# EAGLE design racket (EAGLE 8.4.1)
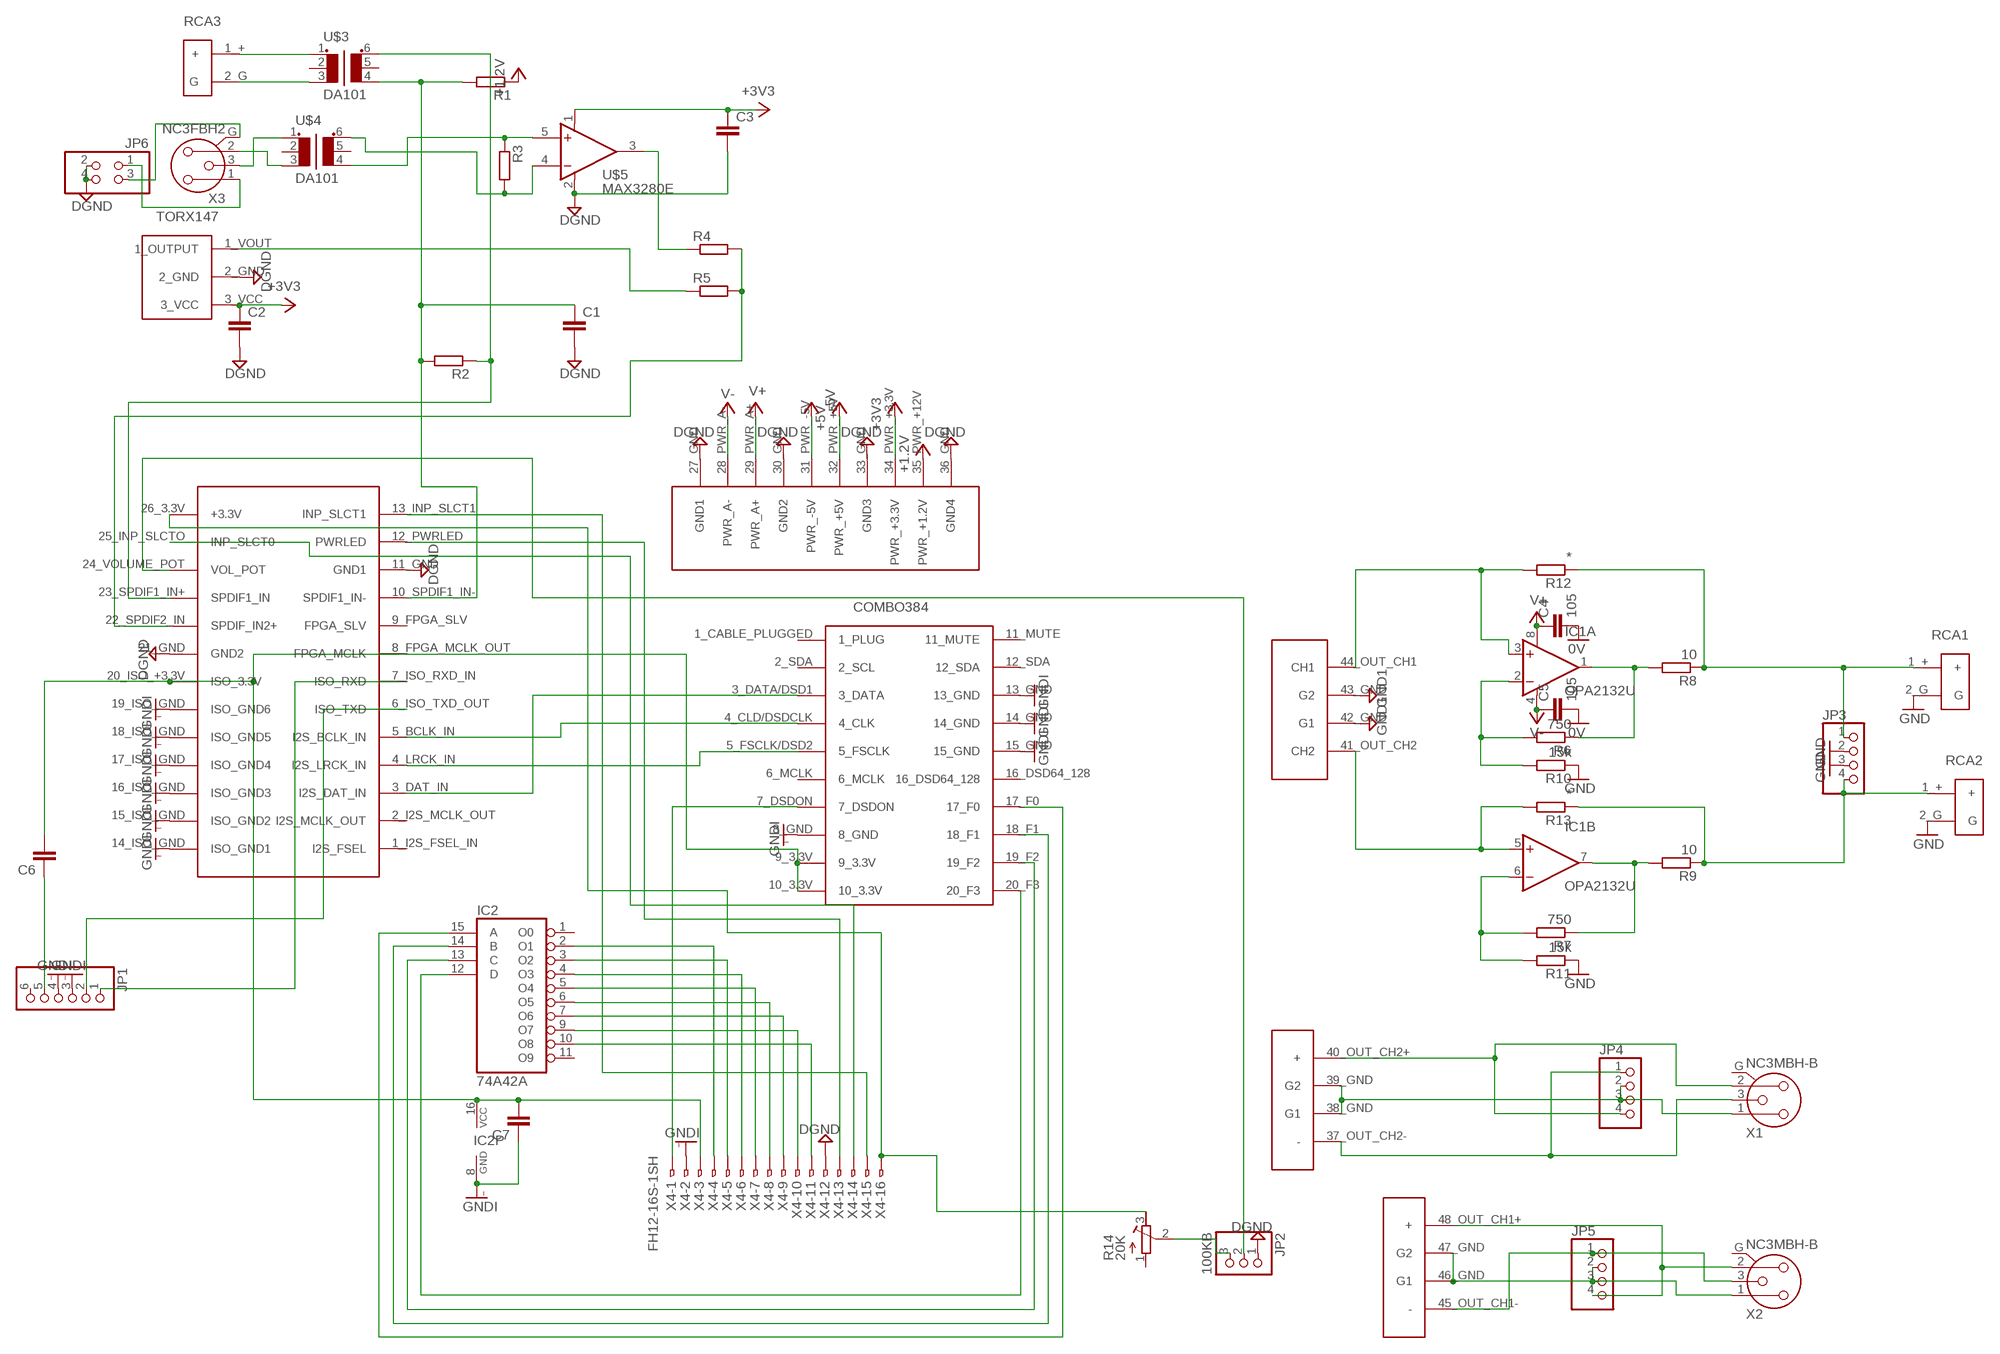
[diagram p0: schematic, sheet 1]

## Parts
C1  C-EUC1206K  [C1206K]
C2  C-EUC1206K  [C1206K]
C3  C-EUC1206K  [C1206K]
C4  105  C-EUC1206K  [C1206K]
C5  105  C-EUC1206K  [C1206K]
C6  C-EUC1206K  [C1206K]
C7  C-EUC1206K  [C1206K]
IC1  OPA2132U  [SO08]
IC2  74A42A  [SO16NS]
JP1  PINHD-1X6  [1X06]
JP2  100KB  PINHD-1X3  [1X03]
JP3  PINHD-1X4  [1X04]
JP4  PINHD-1X4  [1X04]
JP5  PINHD-1X4  [1X04]
JP6  PINHD-2X2  [2X02]
R1  R-EU_M1206  [M1206]
R2  R-EU_M1206  [M1206]
R3  R-EU_M1206  [M1206]
R4  R-EU_M1206  [M1206]
R5  R-EU_M1206  [M1206]
R6  750  R-EU_M1206  [M1206]
R7  750  R-EU_M1206  [M1206]
R8  10  R-EU_M1206  [M1206]
R9  10  R-EU_M1206  [M1206]
R10  15k  R-EU_M1206  [M1206]
R11  15k  R-EU_M1206  [M1206]
R12  *  R-EU_M1206  [M1206]
R13  *  R-EU_M1206  [M1206]
R14  20K  R-TRIMM64W  [RTRIM64W]
RCA1  RCA  [RCA]
RCA2  RCA  [RCA]
RCA3  RCA  [RCA]
U$1  TORX178  [TORX178B]
U$2  DAM1021  [DAM1021]
U$3  DA101  [DAC101]
U$4  DA101  [DAC101]
U$5  MAX3280E  [SOT23-5L]
USB1  COMBO384  [COMBO384_B]
X1  NC3MBH-B  [NC3MBH-B]
X2  NC3MBH-B  [NC3MBH-B]
X3  NC3FBH2  [NC3FBH2]
X4  FH12-16S-1SH  [FH12-16S-1SH]

## Nets
0V: C4.2 C5.2
+1V2: R1.1 U$2.35_PWR_+12V(PWR_+1.2V) ; supply symbol labelled +1.2V
+3V3: C2.1 C3.1 U$1.3_VCC U$2.34_PWR_+3.3V(PWR_+3.3V) U$5.1(V+)
+5V: U$2.32_PWR_+5V(PWR_+5V)
-5V: U$2.31_PWR_-5V(PWR_-5V)
DGND: C1.2 C2.2 C3.2 JP2.1 JP6.2 JP6.4 U$1.2_GND U$2.11_GND(GND1) U$2.21_GND(GND2) U$2.27_GND(GND1) U$2.30_GND(GND2) U$2.33_GND(GND3) U$2.36_GND(GND4) U$5.2(V-) X4.12
GND: JP3.2 JP3.3 R10.1 R11.1 RCA1.2_G(G) RCA2.2_G(G)
GND1: U$2.42_GND(G1) U$2.43_GND(G2)
GNDI: C7.1 IC2.8(GND) JP1.3 JP1.4 U$2.14_ISO_GND(ISO_GND1) U$2.15_ISO_GND(ISO_GND2) U$2.16_ISO_GND(ISO_GND3) U$2.17_ISO_GND(ISO_GND4) U$2.18_ISO_GND(ISO_GND5) U$2.19_ISO_GND(ISO_GND6) USB1.8_GND USB1.13_GND USB1.14_GND USB1.15_GND X4.2
N$2: RCA3.1_+(+) U$3.1
N$3: RCA3.2_G(G) U$3.3
N$4: JP3.4 R9.1 R13.1 RCA2.1_+(+)
N$5: C1.1 R1.2 R2.2 U$2.10_SPDIF1_IN-(SPDIF1_IN-) U$3.4
N$6: R2.1 U$2.23_SPDIF1_IN+(SPDIF1_IN) U$3.6
N$7: JP3.1 R8.1 R12.1 RCA1.1_+(+)
N$8: U$4.3 X3.2
N$9: U$4.1 X3.3
N$10: R3.1 U$4.4 U$5.5(+IN)
N$11: R3.2 U$4.6 U$5.4(-IN)
N$12: R4.1 U$5.3(OUT)
N$13: R5.1 U$1.1_VOUT(1_OUTPUT)
N$14: R4.2 R5.2 U$2.22_SPDIF2_IN(SPDIF_IN2+)
N$15: IC1.3(A:+IN) R12.2 U$2.44_OUT_CH1(CH1)
N$16: JP1.2 U$2.6_ISO_TXD_OUT(ISO_TXD)
N$17: IC1.2(A:-IN) R6.2 R10.2
N$18: IC1.1(A:OUT) R6.1 R8.2
N$19: IC1.6(B:-IN) R7.2 R11.2
N$20: IC1.7(B:OUT) R7.1 R9.2
N$21: IC1.5(B:+IN) R13.2 U$2.41_OUT_CH2(CH2)
N$22: JP1.1 U$2.7_ISO_RXD_IN(ISO_RXD)
N$23: C6.2 C7.2 IC2.16(VCC) U$2.20_ISO_+3.3V(ISO_3.3V) USB1.9_3.3V USB1.10_3.3V X4.3
N$24: C6.1 JP1.5
N$25: IC2.4(O3) X4.6
N$26: USB1.7_DSDON X4.1
N$27: IC2.5(O4) X4.7
N$28: IC2.2(O1) X4.4
N$29: IC2.3(O2) X4.5
N$30: IC2.6(O5) X4.8
N$31: IC2.7(O6) X4.9
N$32: IC2.9(O7) X4.10
N$33: IC2.10(O8) X4.11
N$34: U$2.12_PWRLED(PWRLED) X4.13
N$35: U$2.25_INP_SLCTO(INP_SLCT0) X4.14
N$36: R14.3(E) U$2.26_3.3V(+3.3V) X4.16
N$37: U$2.13_INP_SLCT1(INP_SLCT1) X4.15
N$38: IC2.12(D) USB1.20_F3
N$39: IC2.13(C) USB1.19_F2
N$40: IC2.14(B) USB1.18_F1
N$41: IC2.15(A) USB1.17_F0
N$42: JP2.2 U$2.24_VOLUME_POT(VOL_POT)
N$43: JP2.3 R14.2(S)
N$44: U$2.3_DAT_IN(I2S_DAT_IN) USB1.3_DATA/DSD1(3_DATA)
N$45: U$2.4_LRCK_IN(I2S_LRCK_IN) USB1.5_FSCLK/DSD2(5_FSCLK)
N$46: U$2.5_BCLK_IN(I2S_BCLK_IN) USB1.4_CLD/DSDCLK(4_CLK)
N$47: JP4.4 U$2.40_OUT_CH2+(+) X1.2
N$48: JP4.1 U$2.37_OUT_CH2-(-) X1.3
N$49: JP4.2 JP4.3 U$2.38_GND(G1) U$2.39_GND(G2) X1.1
N$51: JP5.2 JP5.3 U$2.46_GND(G1) U$2.47_GND(G2) X2.1
N$53: JP5.4 U$2.48_OUT_CH1+(+) X2.2
N$54: JP6.3 X3.G
N$55: JP5.1 U$2.45_OUT_CH1-(-) X2.3
N$56: JP6.1 X3.1
V+: C4.1 IC1.8(A:V+) U$2.29_PWR_A+(PWR_A+)
V-: C5.1 IC1.4(A:V-) U$2.28_PWR_A-(PWR_A-)
Unconnected: IC2.1(O0) IC2.11(O9) JP1.6 R14.1(A) U$2.1_I2S_FSEL_IN(I2S_FSEL) U$2.2_I2S_MCLK_OUT(I2S_MCLK_OUT) U$2.8_FPGA_MCLK_OUT(FPGA_MCLK) U$2.9_FPGA_SLV(FPGA_SLV) U$3.2 U$3.5 U$4.2 U$4.5 USB1.1_CABLE_PLUGGED(1_PLUG) USB1.2_SDA(2_SCL) USB1.6_MCLK USB1.11_MUTE USB1.12_SDA USB1.16_DSD64_128 X1.G X2.G

## Library data of the parts
C1-C7 = Vwvwbg:C-EU: CAPACITOR, European symbol
IC1 = burr-brown:OPA2132: High Speed FET-Input Operational Amplifiers< Product Folder:OPA2132; MF: TEXAS INSTRUMENTS; MPN: OPA2132U; OC_FARNELL: 1206934; OC_NEWARK: 80K6015
IC2 = 74xx-eu:74*42: 4-line to 10-line DECODER (1-of-10)
JP1 = pinhead:PINHD-1X6: PIN HEADER
JP2 = pinhead:PINHD-1X3: PIN HEADER
JP3-JP5 = pinhead:PINHD-1X4: PIN HEADER
JP6 = pinhead:PINHD-2X2: PIN HEADER
R1-R13 = Vwvwbg:R-EU_: RESISTOR, European symbol
R14 = resistor:R-TRIMM: Trimm resistor
RCA1-RCA3 = Vwvwbg:RCA
U$1 = Vwvwbg:TORX178
U$2 = Vwvwbg:DAM1021
U$3 U$4 = trafo:DA101
U$5 = maxim:MAX3280E
USB1 = Vwvwbg:COMBO384
X1 X2 = con-neutrik_ag:NC3: Neutrik Audio Connector XLR SERIES Stereo 1/4" jack Source: www.neutrik.com/; MPN: NC3MBH-B; OC_FARNELL: unknown; OC_NEWARK: 27B4288
X3 = con-neutrik_ag:NC3: Neutrik Audio Connector XLR SERIES Stereo 1/4" jack Source: www.neutrik.com/; MPN: NC3FBH2; OC_FARNELL: unknown; OC_NEWARK: 27B4226
X4 = con-hirose:FH12-16S-1S: 1mm Pitch Connectors For FPC/FFC Source: Data sheet <http://www.hirose.co.jp/cataloge_hp/e58605370.pdf>; OC_FARNELL: unknown; OC_NEWARK: unknown

## Board
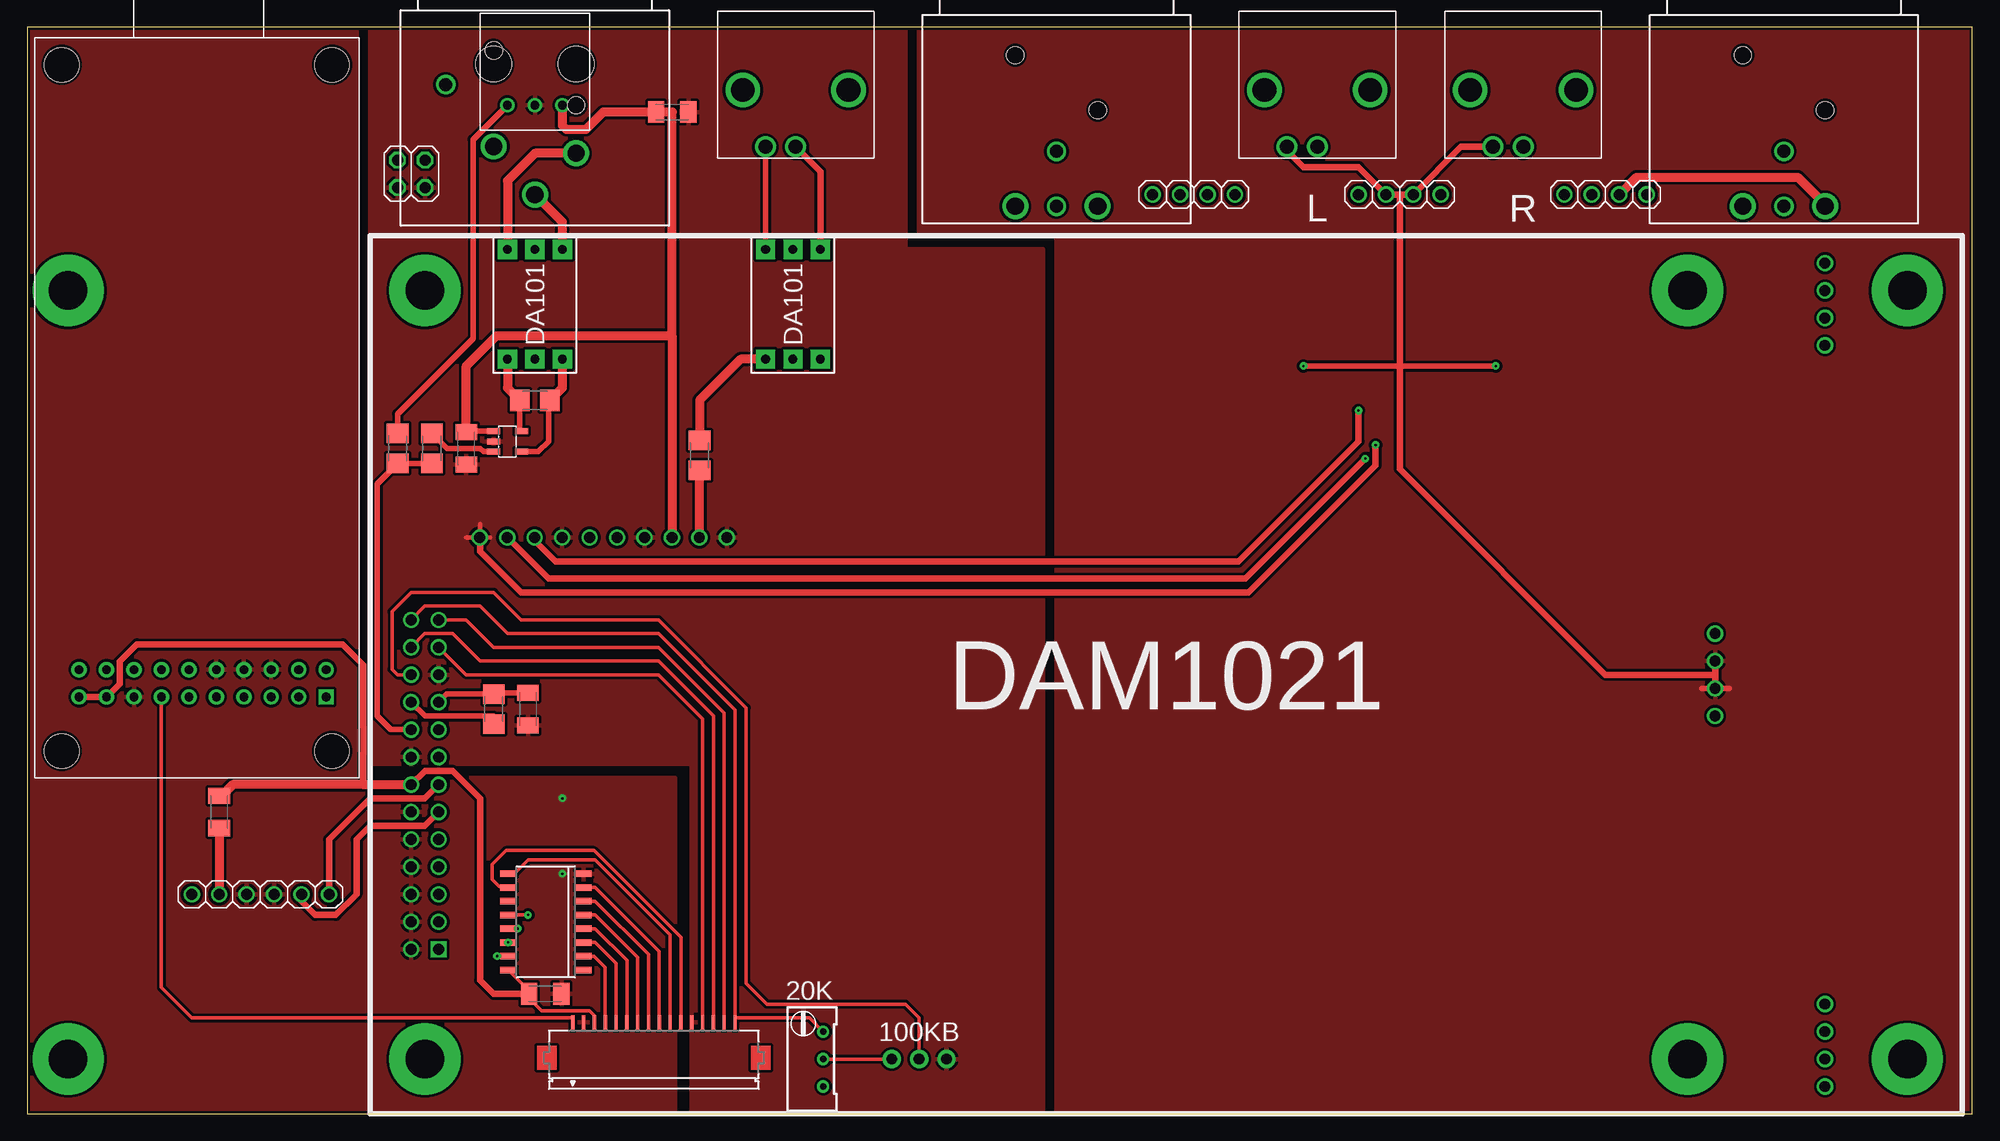
[diagram p1: board, top side]
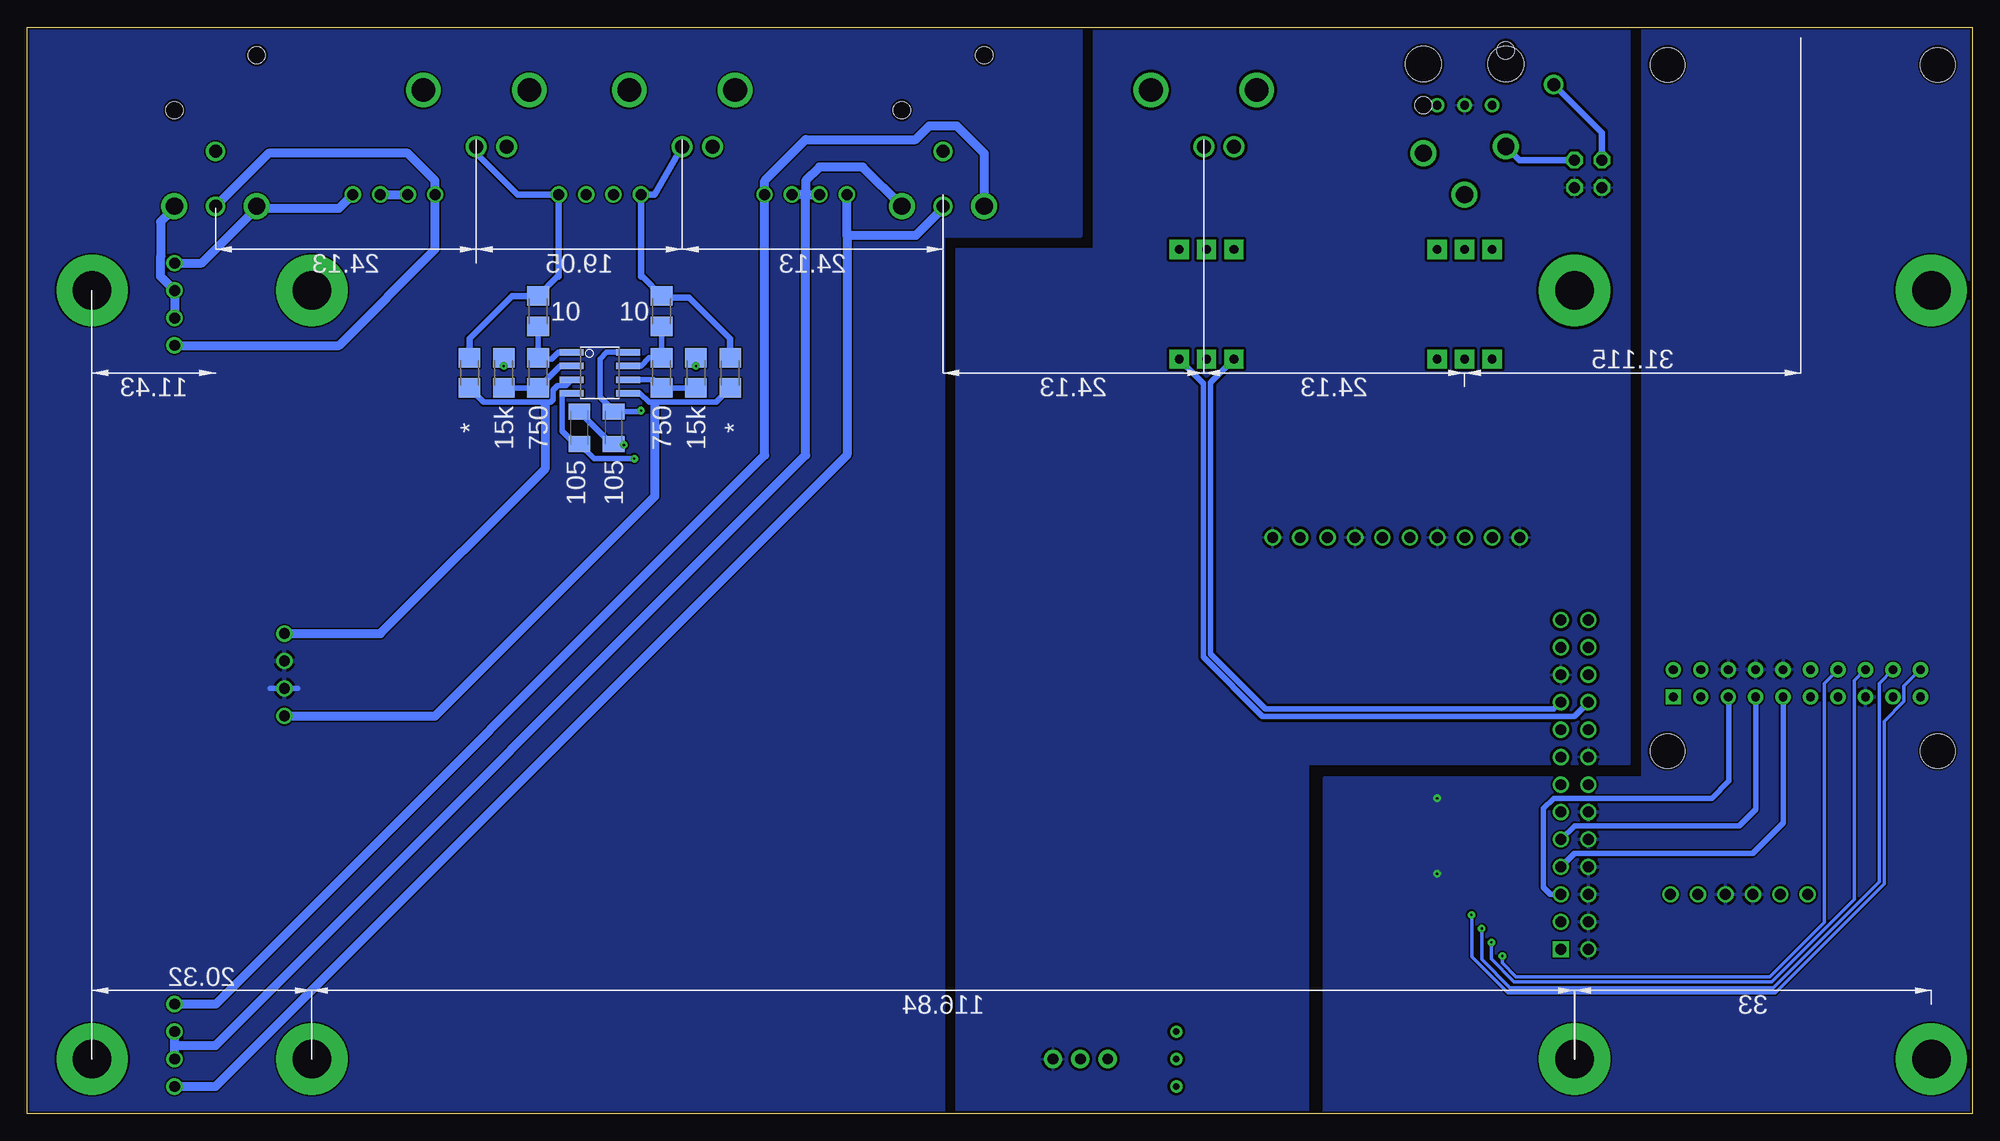
[diagram p2: board, bottom side, seen from below]

Size 180 x 100.58 mm. Coordinates in mm from the lower left corner, seen from the top.
Outline: 0,0 180,0 180,100.58 0,100.58 0,0
Copper layers (1*16): Top 0.035mm / dielectric 1.5mm / Bottom 0.035mm
Design rules "default *": minimum track width 6mil, minimum drill 0.35mm, track to track 6mil, track to pad 6mil, pad to pad 6mil, via to via 6mil, smd to smd 6mil, copper to edge 8mil, drill to drill 6mil, minimum pad ring 10mil, minimum via ring 8mil, stop-mask expansion 4mil, vias tented up to drill 9mil, thermal gap 10mil

### Footprints (pad centres in the part's own frame; a part is rotated, then mirrored left to right if it is on the bottom)
C1206K = smd 1.5 x 2: 1 -1.5,0; 2 1.5,0
SO08 = smd 0.61 x 2.21: 1 -1.905,-2.616; 2 -0.635,-2.616; 3 0.635,-2.616; 4 1.905,-2.616; 5 1.905,2.616; 6 0.635,2.616; 7 -0.635,2.616; 8 -1.905,2.616
SO16NS = smd 0.6 x 1.5: 1 -4.445,-3.49; 2 -3.175,-3.49; 3 -1.905,-3.49; 4 -0.635,-3.49; 5 0.635,-3.49; 6 1.905,-3.49; 7 3.175,-3.49; 8 4.445,-3.49; 9 4.445,3.49; 10 3.175,3.49; 11 1.905,3.49; 12 0.635,3.49; 13 -0.635,3.49; 14 -1.905,3.49; 15 -3.175,3.49; 16 -4.445,3.49
1X06 = drill 1.016: 1 -6.35,0; 2 -3.81,0; 3 -1.27,0; 4 1.27,0; 5 3.81,0; 6 6.35,0
1X03 = drill 1.016 pad 1.676: 1 -2.54,0; 2 0,0; 3 2.54,0
1X04 = drill 1.016: 1 -3.81,0; 2 -1.27,0; 3 1.27,0; 4 3.81,0
2X02 = drill 1.016 octagon: 1 -1.27,-1.27; 2 -1.27,1.27; 3 1.27,-1.27; 4 1.27,1.27
M1206 = smd 1.803 x 2: 1 -1.4,0; 2 1.4,0
RTRIM64W = drill 0.61: 1 1.27,-2.54; 2 1.27,0; 3 1.27,2.54
RCA = drill 1.3: 1_+ 0,0; 2_G -2.8,0 | drill 2.2: 3_NC -4.9,5.25; 4_NC 4.9,5.25
TORX178B = drill 0.8: 1_VOUT -2.54,0; 2_GND 0,0; 3_VCC 2.54,0 | hole 3.3: -3.81,3.81; 3.81,3.81
DAM1021 = drill 1 square: 1_I2S_FSEL_IN 1.27,10.16 | drill 1: 2_I2S_MCLK_OUT 1.27,12.7; 3_DAT_IN 1.27,15.24; 4_LRCK_IN 1.27,17.78; 5_BCLK_IN 1.27,20.32; 6_ISO_TXD_OUT 1.27,22.86; 7_ISO_RXD_IN 1.27,25.4; 8_FPGA_MCLK_OUT 1.27,27.94; 9_FPGA_SLV 1.27,30.48; 10_SPDIF1_IN- 1.27,33.02; 11_GND 1.27,35.56; 12_PWRLED 1.27,38.1; 13_INP_SLCT1 1.27,40.64; 14_ISO_GND -1.27,10.16; 15_ISO_GND -1.27,12.7; 16_ISO_GND -1.27,15.24; 17_ISO_GND -1.27,17.78; 18_ISO_GND -1.27,20.32; 19_ISO_GND -1.27,22.86; 20_ISO_+3.3V -1.27,25.4; 21_GND -1.27,27.94; 22_SPDIF2_IN -1.27,30.48; 23_SPDIF1_IN+ -1.27,33.02; 24_VOLUME_POT -1.27,35.56; 25_INP_SLCTO -1.27,38.1; 26_3.3V -1.27,40.64; 27_GND 5.08,48.26; 28_PWR_A- 7.62,48.26; 29_PWR_A+ 10.16,48.26; 30_GND 12.7,48.26; 31_PWR_-5V 15.24,48.26; 32_PWR_+5V 17.78,48.26; 33_GND 20.32,48.26; 34_PWR_+3.3V 22.86,48.26; 35_PWR_+12V 25.4,48.26; 36_GND 27.94,48.26; 37_OUT_CH2- 129.54,-2.54; 38_GND 129.54,0; 39_GND 129.54,2.54; 40_OUT_CH2+ 129.54,5.08; 41_OUT_CH2 119.38,31.75; 42_GND 119.38,34.29; 43_GND 119.38,36.83; 44_OUT_CH1 119.38,39.37; 45_OUT_CH1- 129.54,66.04; 46_GND 129.54,68.58; 47_GND 129.54,71.12; 48_OUT_CH1+ 129.54,73.66 | drill 3.556 pad 6.604: P$49 0,0; P$50 0,71.12; P$51 137.16,0; P$52 137.16,71.12
DAC101 = drill 0.8 pad 1.778 square: 1 -5.08,2.54; 2 -5.08,0; 3 -5.08,-2.54; 4 5.08,-2.54; 5 5.08,0; 6 5.08,2.54
SOT23-5L = smd 0.55 x 1.2: 1 -0.95,-1.3; 2 0,-1.3; 3 0.95,-1.3; 4 0.95,1.3; 5 -0.95,1.3
COMBO384_B = drill 0.8 pad 1.422 square: 1_CABLE_PLUGGED -11.8,61 | drill 0.8 pad 1.422: 2_SDA -9.26,61; 3_DATA/DSD1 -6.72,61; 4_CLD/DSDCLK -4.18,61; 5_FSCLK/DSD2 -1.64,61; 6_MCLK 0.9,61; 7_DSDON 3.44,61; 8_GND 5.98,61; 9_3.3V 8.52,61; 10_3.3V 11.06,61; 11_MUTE -11.8,58.46; 12_SDA -9.26,58.46; 13_GND -6.72,58.46; 14_GND -4.18,58.46; 15_GND -1.64,58.46; 16_DSD64_128 0.9,58.46; 17_F0 3.44,58.46; 18_F1 5.98,58.46; 19_F2 8.52,58.46; 20_F3 11.06,58.46 | hole 3.2: -12.34,66; -12.34,2.5; 12.66,66; 12.66,2.5
NC3MBH-B = drill 1.6: 1 3.81,0; 2 -3.81,0 | drill 1.2: 3 0,0; G 0,5.08 | hole 1.6: -3.81,13.97; 3.81,8.89
NC3FBH2 = drill 1.6: 1 -3.81,0.635; 2 3.81,0; 3 0.004,-3.822 | drill 1.2: G -8.25,6.355 | hole 1.6: -3.81,9.525; 3.81,4.445
FH12-16S-1SH = smd 0.3 x 1.3: 1 -7.5,3.25; 2 -6.5,3.25; 3 -5.5,3.25; 4 -4.5,3.25; 5 -3.5,3.25; 6 -2.5,3.25; 7 -1.5,3.25; 8 -0.5,3.25; 9 0.5,3.25; 10 1.5,3.25; 11 2.5,3.25; 12 3.5,3.25; 13 4.5,3.25; 14 5.5,3.25; 15 6.5,3.25; 16 7.5,3.25

### Placement (x,y rotation side)
C1  46.35,37.47 270 top
C2  59.69,92.71 0 top
C3  40.64,61.59 270 top
C4  125.73,63.5 270 bottom
C5  128.91,63.5 90 bottom
C6  17.78,27.94 90 top
C7  47.94,11.11 180 top
IC1  127,68.58 270 bottom
IC2  48,17.78 90 top
JP1  21.59,20.32 180 top
JP2  82.55,5.08 180 top
JP3  127,85.09 180 top
JP4  107.95,85.09 0 top
JP5  146.05,85.09 0 top
JP6  35.56,87 180 top
R1  62.23,60.96 90 top
R2  43.18,37.47 90 top
R3  46.99,66.04 0 top
R4  37.47,61.59 270 top
R5  34.29,61.59 270 top
R6  132.72,68.58 270 bottom
R7  121.28,68.58 270 bottom
R8  132.72,74.3 270 bottom
R9  121.28,74.3 270 bottom
R10  135.89,68.58 270 bottom
R11  118.11,68.58 270 bottom
R12  139.06,68.58 270 bottom
R13  114.94,68.58 270 bottom
R14  72.39,5.08 0 top
RCA1  138.43,89.5 0 top
RCA2  119.38,89.5 0 top
RCA3  71.12,89.5 0 top
U$1  46.99,93.34 0 top
U$2  36.81,5.08 0 top
U$3  70.87,74.93 270 top
U$4  46.99,74.93 270 top
U$5  44.45,62.23 270 top
USB1  15.88,99.58 180 top
X1  95.25,84 0 top
X2  162.56,84 0 top
X3  46.99,88.9 0 top
X4  58,5.21 0 top

### Tracks (layer width: path | path; a pad name or v marks a point on that pad's centre or on a via)
0V  (via drill 0.2 pad 0.7)
  Top 0.61: v124.78,61.91 124.78,60.01 113.03,48.26 45.72,48.26 41.91,52.07 41.91,53.34
  Bottom 0.61: C5.2 125.91,62 C4.2 124.86,62 v124.78,61.91
+1V2
  Top 0.813: U$2.35_PWR_+12V 62.23,53.36 R1.1
+3V3
  Top 0.508: U$5.1 40.64,63.18 C3.1
  Top 0.813: U$1.3_VCC 49.53,91.47 49.88,91.12 51.72,91.12 53.31,92.71 C2.1 59.69,92.71 59.67,92.69 59.67,72.01 | 59.67,72.01 U$2.34_PWR_+3.3V | C3.1 40.64,69.22 43.43,72.01 59.67,72.01
DGND
  Top 0.406: 41.91,54.61 41.91,53.34 | 40.64,53.34 42.86,53.34
  Top 0.61: U$2.27_GND 41.91,53.34
  pour Bottom (isolate 0.254, rank 2): 31.75,100.33 81.28,100.33 81.28,80.01 93.98,80.01 93.98,0 61.5,0 61.5,32.38 31.75,32.38
  pour Top (isolate 0.254, rank 2): 81.28,100.33 81.28,80.01 93.98,80.01 93.98,0 61.5,0 61.5,32.38 31.75,32.38 31.75,100.33
GND  (via drill 0.2 pad 0.7)
  Top 0.508: v118.11,69.22 127,69.22 v135.89,69.22
  Top 0.61: 156.21,40.64 146.05,40.64 127,59.69 127,69.22 127,85.09 | 127,85.09 JP3.3 123.19,87.63 118.11,87.63 116.58,89.16 RCA2.2_G | 127,85.09 JP3.2 132.68,89.5 RCA1.2_G
  Bottom 0.508: R11.1 v118.11,69.22 | v135.89,69.22 R10.1
GND1
  Top 0.508: 157.48,39.37 156.21,39.37 154.94,39.37
  Top 0.61: 156.21,41.91 156.21,39.37
  Bottom 0.508: 154.94,39.37 157.48,39.37
  pour Top (isolate 0.254): 179.07,100.33 82.55,100.33 82.55,81.28 95.25,81.28 95.25,0 180.34,0 180.34,100.33
  pour Bottom: 180.34,100.33 82.55,100.33 82.55,81.28 95.25,81.28 95.25,0 180.34,0
GNDI  (via drill 0.2 pad 0.7)
  other vias: 49.53,22.23 49.53,29.21
  pour Top (isolate 0.254): 0,0 59.94,0 59.94,31.11 30.48,31.11 30.48,100.33 0,100.33
  pour Bottom: 0,0 59.94,0 59.94,31.11 30.48,31.11 30.48,100.33 0,100.33
N$1  (via drill 3.56 pad 6.6)
  other vias: 153.65,76.2
N$2
  Top 0.508: 73.66,80.26 U$3.1
  Top 0.61: U$3.1 73.41,87.21 RCA3.1_+
N$3
  Top 0.508: RCA3.2_G U$3.3
N$4
  Bottom 0.61: RCA2.1_+ 121.92,85.09 JP3.4 123.19,77.47 123.06,77.47 R9.1 121.16,75.56 118.75,75.56 114.94,71.75 R13.1
N$5
  Top 0.508: U$2.10_SPDIF1_IN- 38.84,38.87 R2.2 43.28,38.97 C1.1
  Top 0.813: U$3.4 66.04,69.85 62.23,66.04 R1.2
  Bottom 0.305: 70.36,67.82 70.48,67.69
  Bottom 0.508: U$3.4 70.36,67.82 70.46,67.72 | 70.48,67.69 70.48,42.55 65.41,37.47 38.72,37.47 U$2.10_SPDIF1_IN-
N$6
  Top 0.508: U$2.23_SPDIF1_IN+ 35.56,38.1 36.83,36.83 43.18,36.83 R2.1
  Bottom 0.508: U$3.6 71.14,67.59 71.14,42.27 65.68,36.8 36.84,36.8 U$2.23_SPDIF1_IN+
N$7
  Bottom 0.61: R12.1 139.06,71.75 135.12,75.69 R8.1 130.94,77.47 130.81,77.47 JP3.1 134.62,85.09 138.43,88.9 RCA1.1_+
N$8
  Top 0.813: X3.2 46.99,88.9 44.45,86.36 U$4.3
N$9
  Top 0.813: X3.3 47,85.08 49.53,82.55 U$4.1
N$10
  Top 0.508: R3.1 45.59,63.34 U$5.5
  Top 0.813: U$4.4 44.45,67.18 R3.1
N$11
  Top 0.508: U$5.4 47.31,61.28 48.26,62.23 48.26,65.91 R3.2
  Top 0.813: U$4.6 49.53,67.18 48.26,65.91
N$12
  Top 0.508: U$5.3 42.23,61.28 41.91,61.59 38.87,61.59 R4.1
N$13
  Top 0.508: U$1.1_VOUT 41.27,90.17 41.27,71.75 34.29,64.77 R5.1
N$14
  Top 0.508: R4.2 R5.2 32.38,58.29 32.38,36.83 33.66,35.56 U$2.22_SPDIF2_IN
N$15
  Bottom 0.508: IC1.3 130.18,67.39 130.89,67.39 131.31,66.97 131.31,66.11 131.55,65.87 | R12.2 137.76,65.87 131.55,65.87 | 131.55,65.87 131.93,65.87 132.08,65.72
  Bottom 0.813: 132.08,65.72 132.08,59.69 147.32,44.45 U$2.44_OUT_CH1
N$16
  Top 0.61: U$2.6_ISO_TXD_OUT 36.81,26.67 31.75,26.67 30.48,25.4 30.48,20.32 28.57,18.41 26.67,18.41 25.4,19.68 JP1.2
N$17
  Bottom 0.508: R10.2 R6.2 130.68,69.22 IC1.2
N$18
  Bottom 0.508: IC1.1 130.81,70.48 131.44,69.85 132.59,69.85 R6.1 R8.2
N$19
  Bottom 0.508: R11.2 R7.2 122.05,67.94 IC1.6
N$20
  Bottom 0.508: IC1.7 123.19,69.22 122.42,69.98 R7.1 R9.2
N$21
  Bottom 0.508: IC1.5 123.26,66.67 122.45,65.87 | R13.2 116.24,65.87 122.45,65.87 | 122.45,65.87 122.07,65.87 121.92,65.72
  Bottom 0.813: 121.92,65.72 121.92,57.15 142.24,36.83 U$2.41_OUT_CH2
N$22
  Top 0.61: U$2.7_ISO_RXD_IN 36.81,29.21 31.75,29.21 27.94,25.4 JP1.1
N$23
  Top 0.305: X4.3 52.5,9.1 52.07,9.53 47.62,9.53 46.44,10.71 C7.2 46.44,11.4 IC2.16
  Top 0.61: U$2.20_ISO_+3.3V 35.56,30.48 36.83,31.75 39.37,31.75 41.91,29.21 41.91,12.38 43.18,11.11 C7.2 | USB1.10_3.3V USB1.9_3.3V 8.57,39.8 8.57,41.86 10.16,43.45 29.21,43.45 31.11,41.55 31.11,35.81 31.14,35.79 31.14,33.37 31.11,33.35 31.11,30.48
  Top 0.813: C6.2 18.01,29.44 19.05,30.48 31.11,30.48 U$2.20_ISO_+3.3V
N$24
  Top 0.813: C6.1 JP1.5
N$25
  Top 0.305: X4.6 55.5,14.22 52.58,17.14 IC2.4
N$26
  Top 0.305: USB1.7_DSDON 12.44,11.7 15.24,8.89 50.48,8.89 50.5,8.87 X4.1
N$27
  Top 0.305: X4.7 56.5,14.49 52.58,18.41 IC2.5
N$28
  Top 0.305: X4.4 53.5,13.56 52.45,14.61 IC2.2
N$29
  Top 0.305: X4.5 54.5,13.95 52.58,15.88 IC2.3
N$30
  Top 0.305: X4.8 57.5,14.76 52.58,19.68 IC2.6
N$31
  Top 0.305: X4.9 58.5,15.03 52.58,20.95 IC2.7
N$32
  Top 0.305: X4.10 59.5,16.57 52.58,23.5 46.35,23.5 45.09,22.23 IC2.9
N$33
  Top 0.305: X4.11 60.5,16.34 52.45,24.38 44.32,24.38 43.05,23.11 43.05,21.72 43.69,21.08 44.38,21.08 IC2.10
N$34
  Top 0.305: X4.13 62.5,36.56 58.42,40.64 40.64,40.64 38.1,43.18 U$2.12_PWRLED
N$35
  Top 0.305: U$2.25_INP_SLCTO 36.81,44.45 39.37,44.45 41.91,41.91 58.42,41.91 63.5,36.83 X4.14
N$36
  Top 0.305: U$2.26_3.3V 36.81,46.99 41.91,46.99 44.45,44.45 58.42,44.45 65.5,37.37 65.5,8.89 | 65.5,8.89 X4.16 | R14.3 72.39,8.89 65.5,8.89
N$37
  Top 0.305: U$2.13_INP_SLCT1 40.64,45.72 43.18,43.18 58.42,43.18 64.5,37.1 X4.15
N$38  (via drill 0.2 pad 0.7)
  Top 0.305: IC2.12 v46.35,18.41
  Bottom 0.305: USB1.20_F3 6.34,39.6 6.34,38.16 8.18,36.32 8.18,21.27 18.23,11.23 42.99,11.23 46.3,14.54 46.3,18.36 v46.35,18.41
N$39  (via drill 0.2 pad 0.7)
  Top 0.305: IC2.13 v45.4,17.14
  Bottom 0.305: USB1.19_F2 8.64,39.84 8.64,21.46 18.41,11.68 42.8,11.68 45.4,14.29 v45.4,17.14
N$40  (via drill 0.2 pad 0.7)
  Bottom 0.305: 9.89,40.86 USB1.18_F1 10.92,40.1 10.92,19.88 18.55,12.24 42.42,12.24 44.51,14.34 44.51,14.41 44.51,14.42 IC2.14
  other vias: 44.51,15.88
N$41  (via drill 0.2 pad 0.7)
  Top 0.305: 44.8,14.73 IC2.15 v43.5,14.61
  Bottom 0.305: USB1.17_F0 13.72,39.84 13.72,17.73 18.74,12.7 42.23,12.7 43.5,13.97 v43.5,14.61
N$42
  Top 0.305: JP2.2 82.55,7.62 82.55,8.89 81.28,10.16 80.01,10.16 69.85,10.16 | 69.85,10.16 68.58,10.16 | 69.85,10.16 68.45,10.16 66.55,12.06 66.55,37.59 58.42,45.72 45.72,45.72 43.18,48.26 35.56,48.26 33.78,46.48 33.78,41.15 34.29,40.64 U$2.24_VOLUME_POT
N$43
  Top 0.305: JP2.3 R14.2
N$44
  Bottom 0.508: U$2.3_DAT_IN 39.05,20.32 39.69,20.95 39.69,28.26 38.73,29.21 24.13,29.21 22.54,30.8 22.54,38.53 USB1.3_DATA/DSD1
N$45
  Bottom 0.508: U$2.4_LRCK_IN 36.83,24.11 36.83,24.13 20.32,24.13 17.52,26.93 USB1.5_FSCLK/DSD2
N$46
  Bottom 0.508: U$2.5_BCLK_IN 36.81,26.67 21.59,26.67 20.05,28.2 USB1.4_CLD/DSDCLK
N$47
  Bottom 0.813: U$2.40_OUT_CH2+ 162.56,10.16 111.76,60.96 JP4.4 111.76,86.36 107.95,90.17 97.79,90.17 96.52,91.44 93.98,91.44 91.44,88.9 X1.2
N$48
  Bottom 0.813: U$2.37_OUT_CH2- 162.56,2.54 104.14,60.96 104.14,81.28 | 104.14,81.28 JP4.1 | X1.3 95.25,83.82 97.79,81.28 104.14,81.28
N$49
  Bottom 0.813: U$2.38_GND 166.35,6.35 | 166.35,6.35 U$2.39_GND | 166.35,6.35 162.56,6.35 107.95,60.96 107.95,85.09 | 107.95,85.09 JP4.3 | 107.95,85.09 JP4.2 | X1.1 102.69,87.63 106.68,87.63 107.95,86.36 107.95,85.09
N$50  (via drill 3.56 pad 6.6)
  other vias: 3.81,5.08
N$51
  Top 0.813: JP5.3 148.91,86.68 163.83,86.68 166.37,84.14 X2.1
  Bottom 0.813: JP5.3 JP5.2 | X2.1 166.37,83.82 167.64,82.55 167.64,79.31 167.66,79.28 167.66,77.51 U$2.47_GND U$2.46_GND
N$52  (via drill 3.56 pad 6.6)
  other vias: 153.65,5.08
N$53
  Bottom 0.813: JP5.4 151.13,83.82 158.57,83.82 | 158.57,83.82 X2.2 | U$2.48_OUT_CH1+ 163.83,78.74 158.75,83.82 158.57,83.82
N$54
  Bottom 0.61: X3.G 34.29,90.81 JP6.3
N$55
  Bottom 0.813: U$2.45_OUT_CH1- 151.13,71.12 142.24,80.01 JP5.1 142.24,86.36 144.78,88.9 157.66,88.9 X2.3
N$56
  Bottom 0.61: X3.1 41.91,88.27 JP6.1
N$57  (via drill 3.56 pad 6.6)
  other vias: 3.81,76.2
V+  (via drill 0.2 pad 0.7)
  Top 0.508: v123.19,65.09 123.19,64.77
  Top 0.61: U$2.29_PWR_A+ 46.97,53.04 48.9,51.12 112.08,51.12 123.19,62.23 v123.19,65.09
  Bottom 0.508: IC1.8 126.36,70.48 127,69.85 127,66.36 125.73,65.09 C4.1 123.28,65 v123.19,65.09
V-  (via drill 0.2 pad 0.7)
  Top 0.61: U$2.28_PWR_A- 44.45,53.34 48.26,49.53 112.71,49.53 v123.83,60.64
  Bottom 0.508: IC1.4 130.49,66.67 130.49,63.18 129.31,62 C5.1 127.55,60.64 v123.83,60.64

### Text on the board
tPlace: L | R | 20K | 100KB
bPlace: 10 | 10 | * | 15k | 750 | 750 | 15k | * | 105 | 105